# Altium schematic sheet Direction Pad.SchDoc
size A4; SheetNumber: 3; SheetTotal: 3
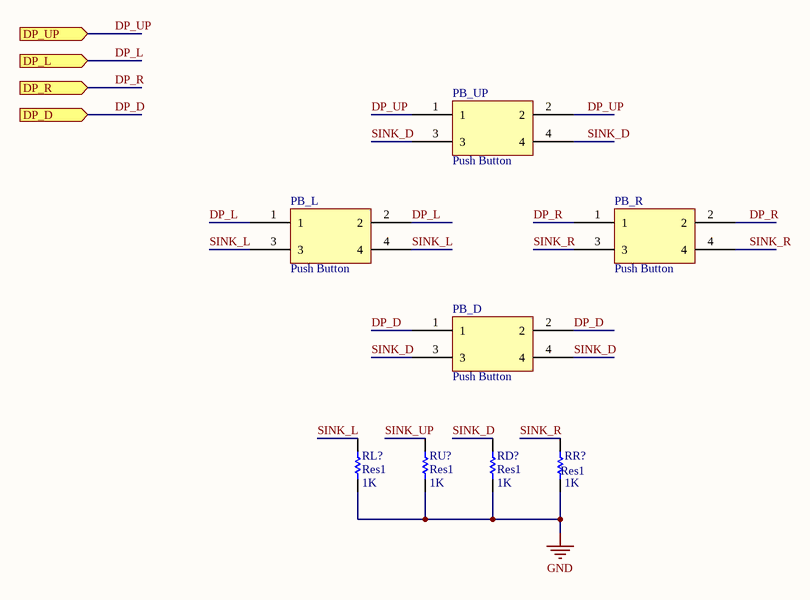
[diagram p0: Direction Pad.SchDoc]

## Parts
PB_D  Push Button
PB_L  Push Button
PB_R  Push Button
PB_UP  Push Button
RD?  Res1  value 1K  [AXIAL-0.3]
RL?  Res1  value 1K  [AXIAL-0.3]
RR?  Res1  value 1K  [AXIAL-0.3]
RU?  Res1  value 1K  [AXIAL-0.3]

## Ports
DP_D (in), DP_L (in), DP_R (in), DP_UP (in)

## Nets
GND: RD?.1 RL?.1 RR?.1 RU?.1
DP_D: PB_D.1 PB_D.2 ; port DP_D
DP_L: PB_L.1 PB_L.2 ; port DP_L
DP_R: PB_R.1 PB_R.2 ; port DP_R
DP_UP: PB_UP.1 PB_UP.2 ; port DP_UP
SINK_D: PB_D.3 PB_D.4 PB_UP.3 PB_UP.4 RD?.2
SINK_L: PB_L.3 PB_L.4 RL?.2
SINK_R: PB_R.3 PB_R.4 RR?.2
SINK_UP: RU?.2

## Library data of the parts
RD? RL? RR? RU? = Res1: Resistor; Published: 8-Jun-2000; LatestRevisionDate: 17-Jul-2002; LatestRevisionNote: Re-released for DXP Platform.; PackageReference: AXIAL-0.3; Publisher: Altium Limited; PackageDescription: Axial Device, Thru-Hole; 2 Leads; 0.3 in Pin Spacing